# EasyEDA schematic Proximity Sensor.json
TITLE: Proximity sensor lm358; REV: 1.0; Date: 2020-04-23; Sheet: 1/1; Company: Evandrojr
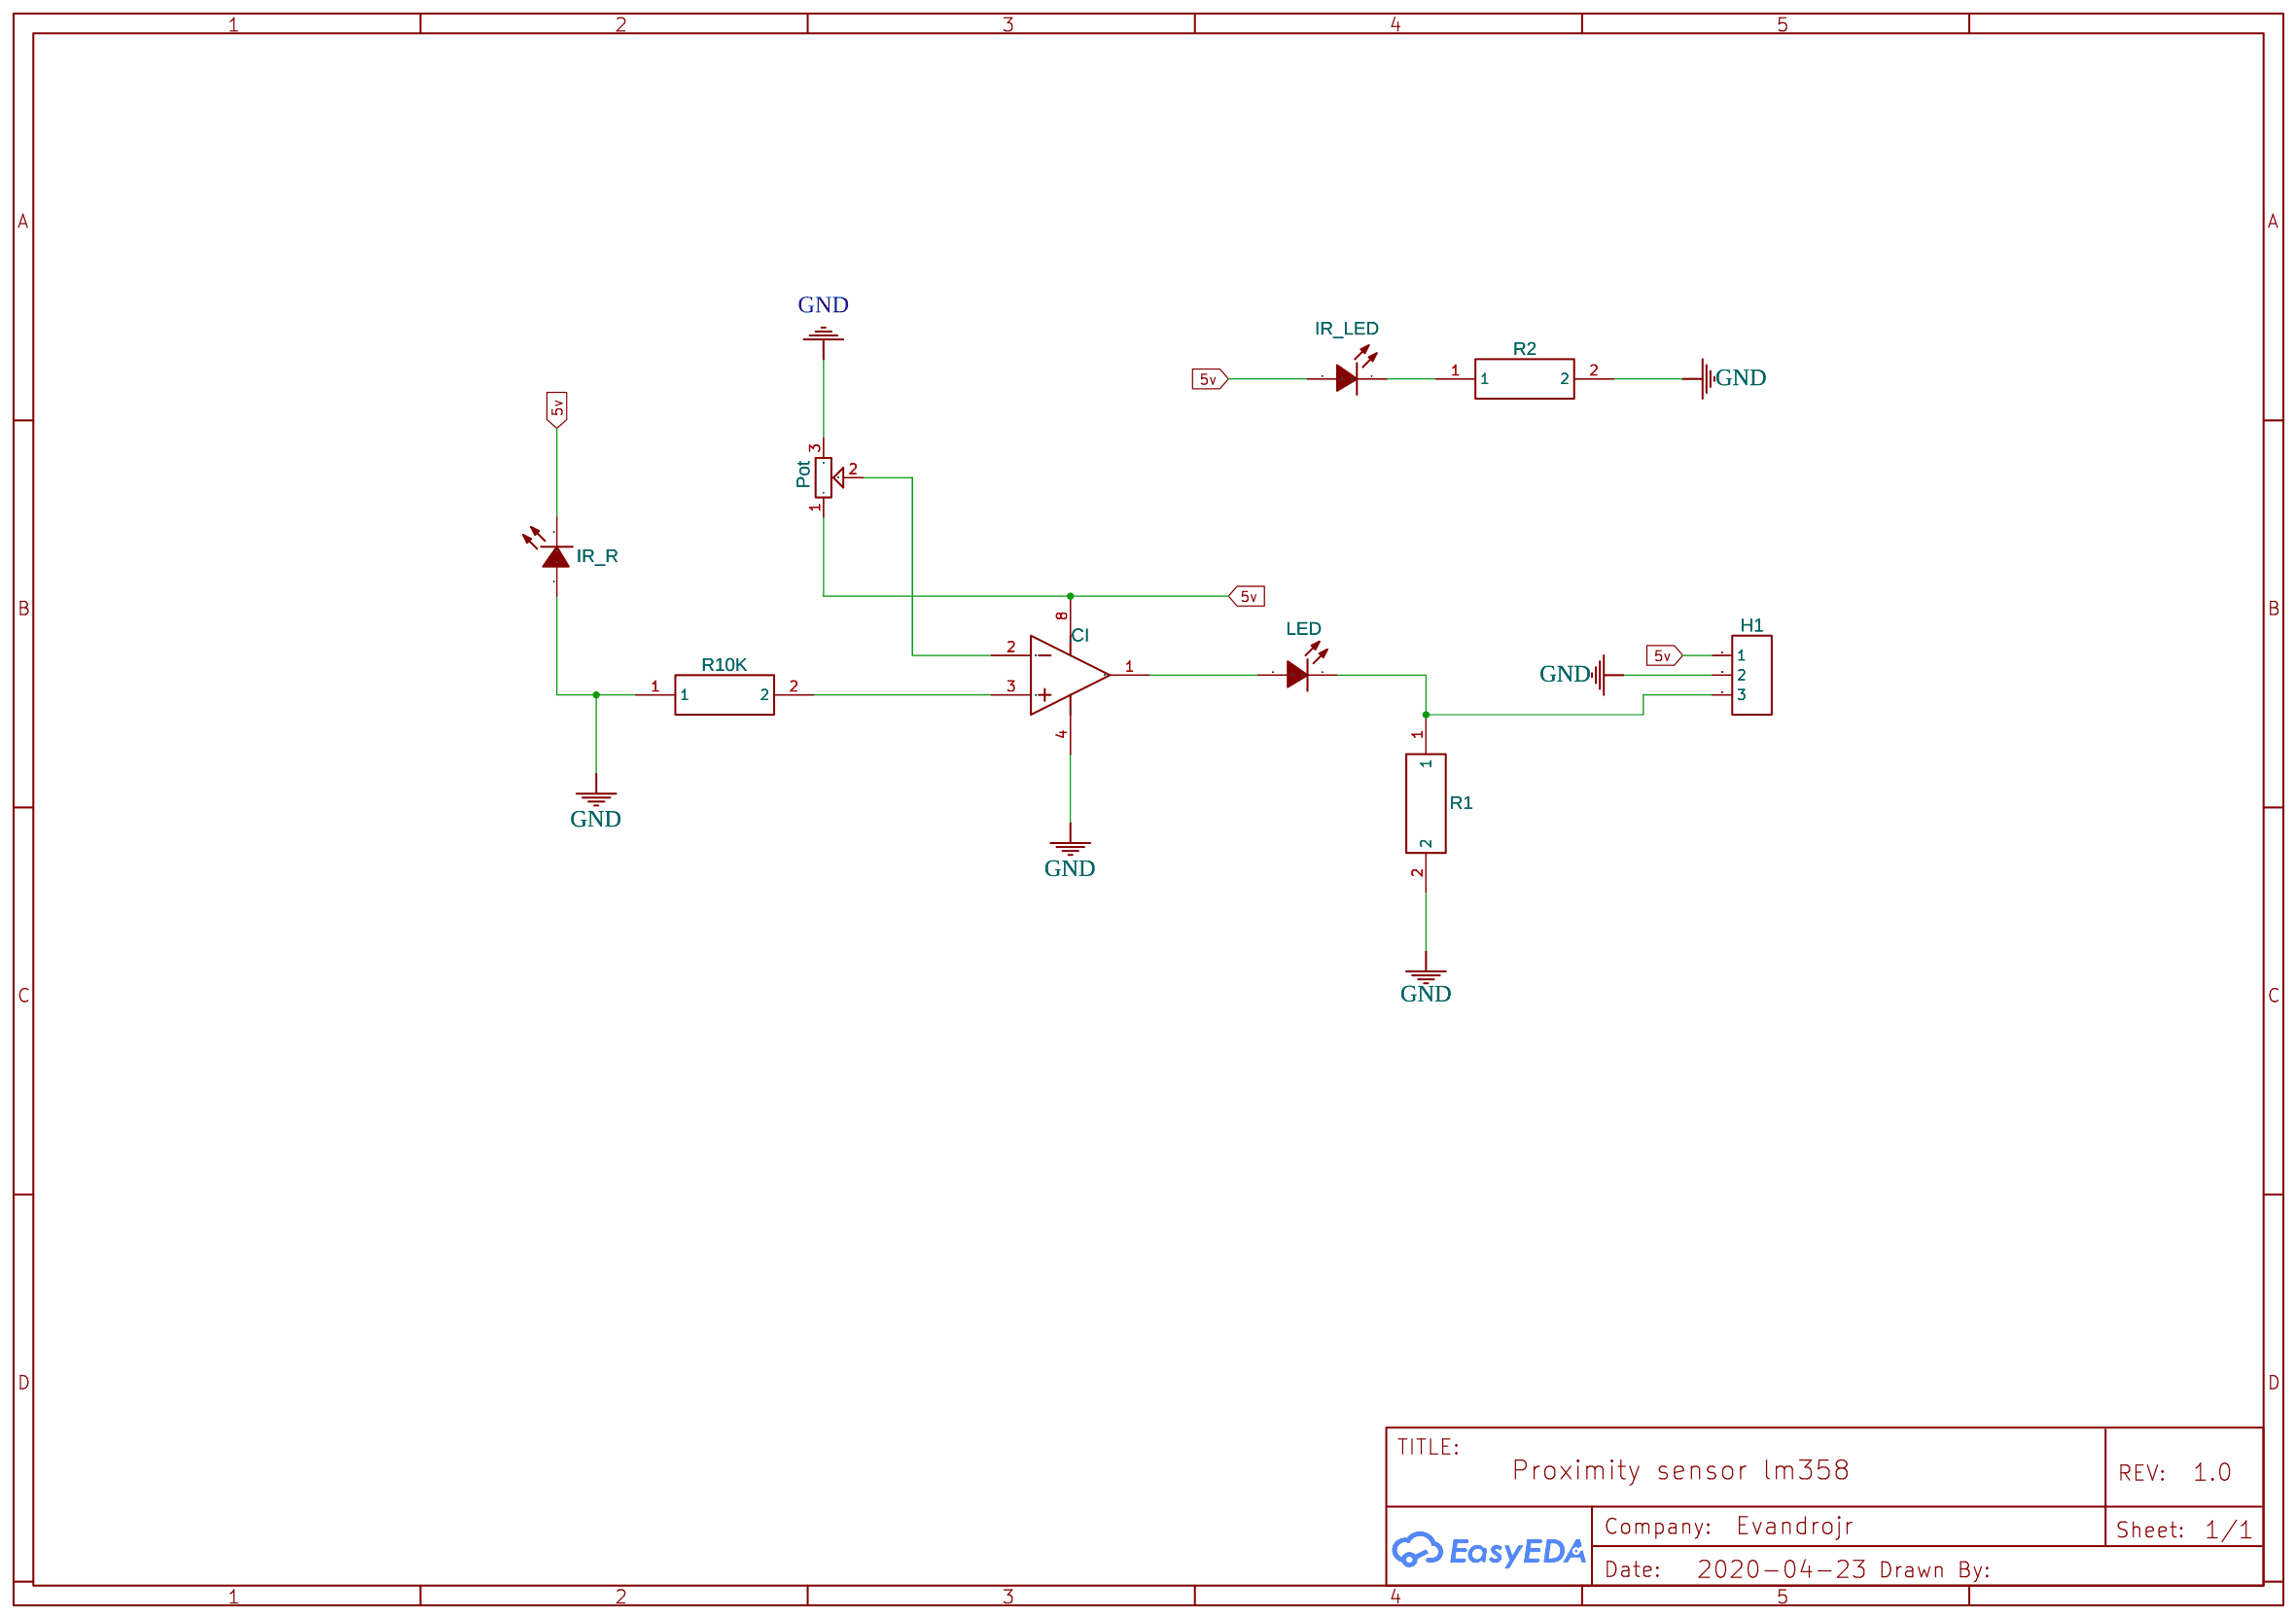
[diagram p0: schematic sheet]

## Parts
D1  LED  [LED]
H1  HDR-F-2.54_1x3  [HDR-F-2.54_1X3]
IR_LED  LED  [LED]
IR_R  LED  [LED]
PT  Pot  [POTENTIOMÈTRE 10K]
R1  RESITOR  [1/8W RESISTOR]
R2  RESITOR  [1/8W RESISTOR]
R10K  RESITOR  [1/8W RESISTOR]
U1  CI  [SOP-8_L4.9-W3.9-P1.27-LS6.0-BL]  (section 1)

## Library data of the parts
D1 IR_LED IR_R = LED
H1 = HDR-F-2.54_1x3: Supplier Part: C146690; Supplier: LCSC; Contributor: LCEDA_Lib
PT = Potentionmètre 10K: Manufacturer Part: 001045026185; Supplier Part: WEL3266-Y-103-LF; Manufacturer: Weltron; Contributor: Lucante
R1 R2 R10K = RESITOR: Contributor: rander
U1 = LM358M/TR: Supplier: LCSC; Supplier Part: C398078; Manufacturer: HGSEMI; subpart_no: 1

## Nets
5v: H1.1 IR_LED.A IR_R.K PT.1(A) U1.8(VCC)
GND: H1.2 IR_R.A PT.3(E) R1.2 R2.2 R10K.1 U1.4(GND)
Net-(D1-A): D1.A U1.1(1OUT)
Net-(D1-K): D1.K H1.3 R1.1
Net-(IR_LED-K): IR_LED.K R2.1
Net-(PT-2): PT.2(S) U1.2(1IN-)
Net-(R10K-2): R10K.2 U1.3(1IN+)
